# EAGLE design thermochromic heater control v2 (EAGLE 9.4.2)
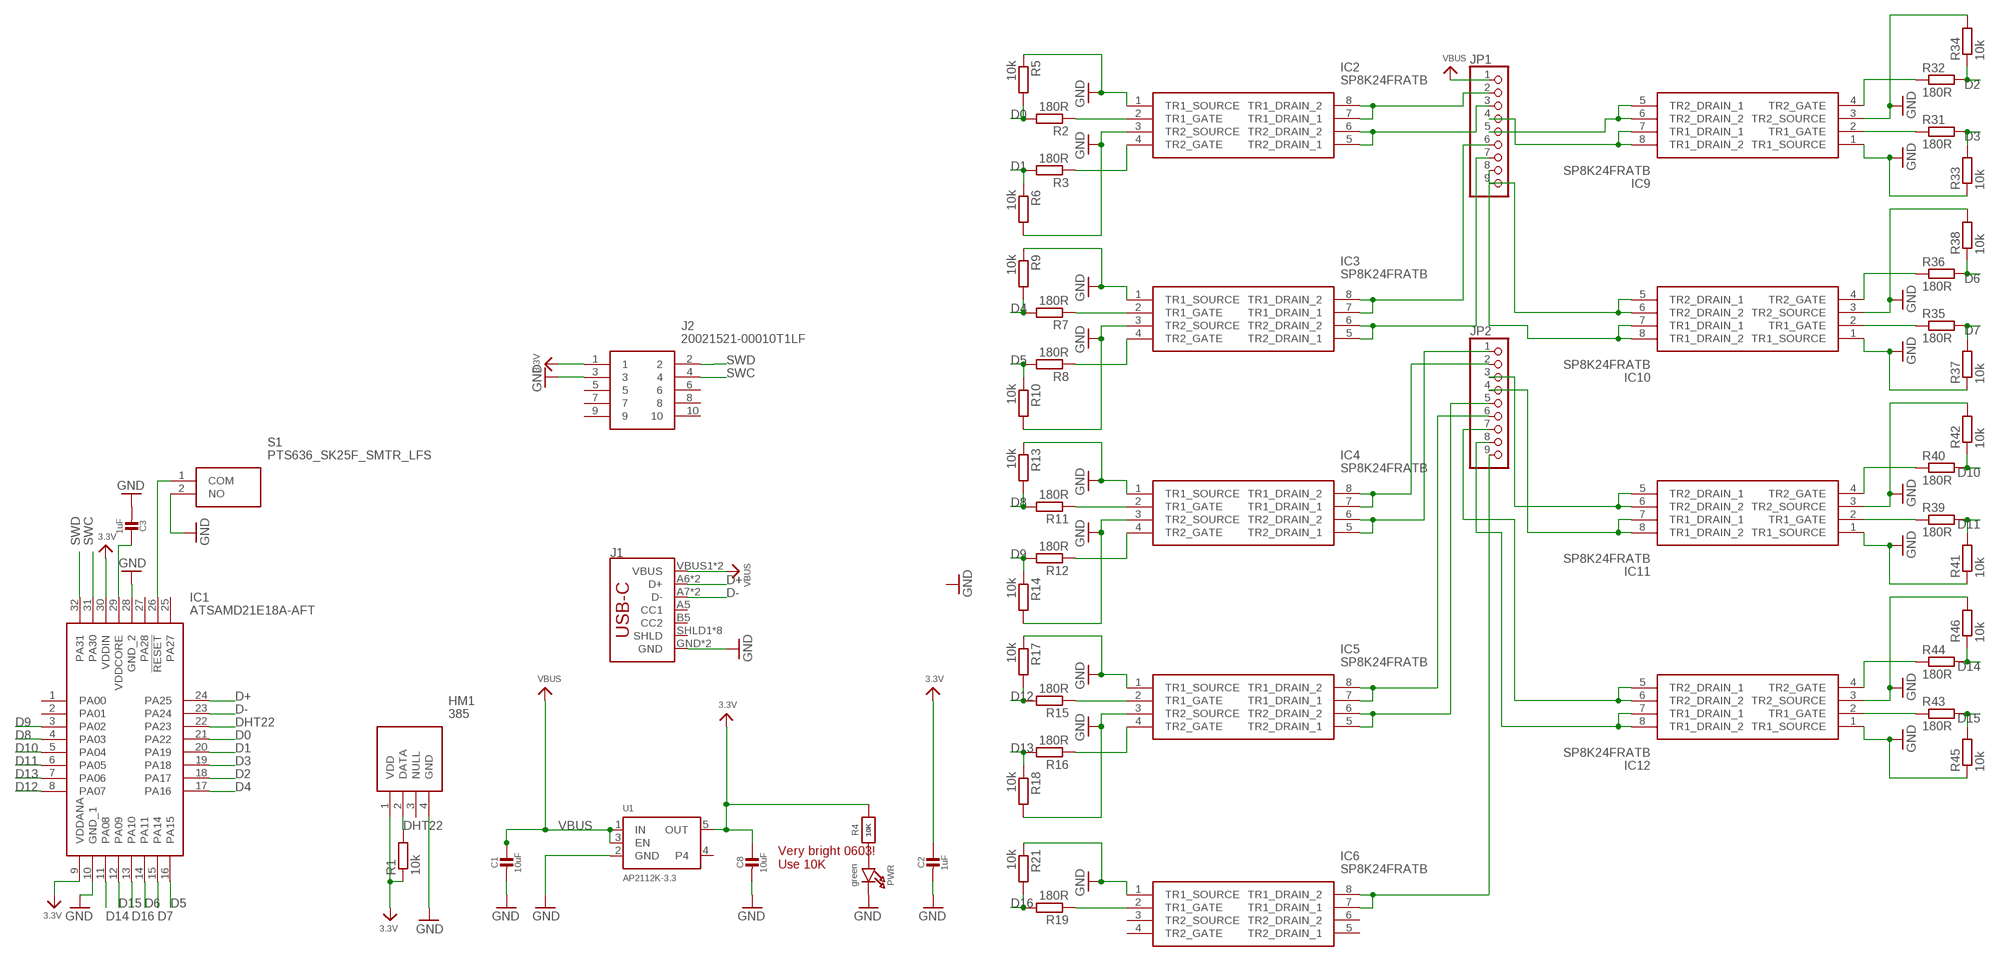
[diagram p0: schematic, sheet 1]

## Parts
C1  10uF  CAP_CERAMIC0805-NOOUTLINE  [0805-NO]
C2  1uF  CAP_CERAMIC0603_NO  [0603-NO]
C3  1uF  CAP_CERAMIC0603_NO  [0603-NO]
C8  10uF  CAP_CERAMIC0805-NOOUTLINE  [0805-NO]
HM1  385  [TO200P770X1510X2520-4P]
IC1  ATSAMD21E18A-AFT  [QFP80P900X900X120-32N]
IC2  SP8K24FRATB  [SOIC127P600X175-8N]
IC3  SP8K24FRATB  [SOIC127P600X175-8N]
IC4  SP8K24FRATB  [SOIC127P600X175-8N]
IC5  SP8K24FRATB  [SOIC127P600X175-8N]
IC6  SP8K24FRATB  [SOIC127P600X175-8N]
IC9  SP8K24FRATB  [SOIC127P600X175-8N]
IC10  SP8K24FRATB  [SOIC127P600X175-8N]
IC11  SP8K24FRATB  [SOIC127P600X175-8N]
IC12  SP8K24FRATB  [SOIC127P600X175-8N]
J1  USB_C2-LAYER  [USB-C-16P]
J2  20021521-00010T1LF  [2002152100010T1LF]
JP1  PINHD-1X9  [1X09]
JP2  PINHD-1X9  [1X09]
PWR  green  LED0603_NOOUTLINE  [CHIPLED_0603_NOOUTLINE]
R1  10k  R-EU_R0603  [R0603]
R2  180R  R-EU_R0603  [R0603]
R3  180R  R-EU_R0603  [R0603]
R4  10K  RESISTOR_0603_NOOUT  [0603-NO]
R5  10k  R-EU_R0603  [R0603]
R6  10k  R-EU_R0603  [R0603]
R7  180R  R-EU_R0603  [R0603]
R8  180R  R-EU_R0603  [R0603]
R9  10k  R-EU_R0603  [R0603]
R10  10k  R-EU_R0603  [R0603]
R11  180R  R-EU_R0603  [R0603]
R12  180R  R-EU_R0603  [R0603]
R13  10k  R-EU_R0603  [R0603]
R14  10k  R-EU_R0603  [R0603]
R15  180R  R-EU_R0603  [R0603]
R16  180R  R-EU_R0603  [R0603]
R17  10k  R-EU_R0603  [R0603]
R18  10k  R-EU_R0603  [R0603]
R19  180R  R-EU_R0603  [R0603]
R21  10k  R-EU_R0603  [R0603]
R31  180R  R-EU_R0603  [R0603]
R32  180R  R-EU_R0603  [R0603]
R33  10k  R-EU_R0603  [R0603]
R34  10k  R-EU_R0603  [R0603]
R35  180R  R-EU_R0603  [R0603]
R36  180R  R-EU_R0603  [R0603]
R37  10k  R-EU_R0603  [R0603]
R38  10k  R-EU_R0603  [R0603]
R39  180R  R-EU_R0603  [R0603]
R40  180R  R-EU_R0603  [R0603]
R41  10k  R-EU_R0603  [R0603]
R42  10k  R-EU_R0603  [R0603]
R43  180R  R-EU_R0603  [R0603]
R44  180R  R-EU_R0603  [R0603]
R45  10k  R-EU_R0603  [R0603]
R46  10k  R-EU_R0603  [R0603]
S1  PTS636_SK25F_SMTR_LFS  [PTS636SK25FSMTRLFS]
U1  AP2112K-3.3  VREG_SOT23-5  [SOT23-5]

## Nets
3.3V: C2.1 C8.1 HM1.1(VDD) IC1.9(VDDANA) IC1.30(VDDIN) J2.1 R1.1 R4.2 U1.5(OUT)
D0: IC1.21(PA22) R2.2 R5.2
D1: IC1.20(PA19) R3.2 R6.1
D2: IC1.18(PA17) R32.2 R34.1
D3: IC1.19(PA18) R31.2 R33.2
D4: IC1.17(PA16) R7.2 R9.2
D5: IC1.16(PA15) R8.2 R10.1
D6: IC1.14(PA11) R36.2 R38.1
D7: IC1.15(PA14) R35.2 R37.2
D8: IC1.4(PA03) R11.2 R13.2
D9: IC1.3(PA02) R12.2 R14.1
D10: IC1.5(PA04) R40.2 R42.1
D11: IC1.6(PA05) R39.2 R41.2
D12: IC1.8(PA07) R15.2 R17.2
D13: IC1.7(PA06) R16.2 R18.1
D14: IC1.11(PA08) R44.2 R46.1
D15: IC1.12(PA09) R43.2 R45.2
D16: IC1.13(PA10) R19.2 R21.2
D+: IC1.24(PA25) J1.A6(D+) J1.B6(D+)
D-: IC1.23(PA24) J1.A7(D-) J1.B7(D-)
DHT22: HM1.2(DATA) IC1.22(PA23) R1.2
GND: C1.2 C2.2 C3.2 C8.2 HM1.4(GND) IC1.10(GND_1) IC1.28(GND_2) IC2.1(TR1_SOURCE) IC2.3(TR2_SOURCE) IC3.1(TR1_SOURCE) IC3.3(TR2_SOURCE) IC4.1(TR1_SOURCE) IC4.3(TR2_SOURCE) IC5.1(TR1_SOURCE) IC5.3(TR2_SOURCE) IC6.1(TR1_SOURCE) IC9.1(TR1_SOURCE) IC9.3(TR2_SOURCE) IC10.1(TR1_SOURCE) IC10.3(TR2_SOURCE) IC11.1(TR1_SOURCE) IC11.3(TR2_SOURCE) IC12.1(TR1_SOURCE) IC12.3(TR2_SOURCE) J1.GND J1.GND2(GND) J2.3 PWR.C R5.1 R6.2 R9.1 R10.2 R13.1 R14.2 R17.1 R18.2 R21.1 R33.1 R34.2 R37.1 R38.2 R41.1 R42.2 R45.1 R46.2 S1.2(NO) U1.2(GND)
N$3: C3.1 IC1.29(VDDCORE)
N$4: IC2.2(TR1_GATE) R2.1
N$5: IC1.26(!RESET) S1.1(COM)
N$6: PWR.A R4.1
N$7: IC2.4(TR2_GATE) R3.1
N$8: IC2.7(TR1_DRAIN_1) IC2.8(TR1_DRAIN_2) JP1.2
N$9: IC2.5(TR2_DRAIN_1) IC2.6(TR2_DRAIN_2) JP1.3
N$10: IC10.2(TR1_GATE) R35.1
N$11: IC3.2(TR1_GATE) R7.1
N$12: IC3.4(TR2_GATE) R8.1
N$13: IC3.7(TR1_DRAIN_1) IC3.8(TR1_DRAIN_2) JP1.6
N$14: IC3.5(TR2_DRAIN_1) IC3.6(TR2_DRAIN_2) JP1.7
N$15: IC4.2(TR1_GATE) R11.1
N$16: IC4.4(TR2_GATE) R12.1
N$17: IC4.7(TR1_DRAIN_1) IC4.8(TR1_DRAIN_2) JP2.2
N$18: IC4.5(TR2_DRAIN_1) IC4.6(TR2_DRAIN_2) JP2.1
N$19: IC5.2(TR1_GATE) R15.1
N$20: IC5.4(TR2_GATE) R16.1
N$21: IC5.7(TR1_DRAIN_1) IC5.8(TR1_DRAIN_2) JP2.6
N$22: IC5.5(TR2_DRAIN_1) IC5.6(TR2_DRAIN_2) JP2.5
N$23: IC6.2(TR1_GATE) R19.1
N$25: IC6.7(TR1_DRAIN_1) IC6.8(TR1_DRAIN_2) JP2.9
N$35: IC9.2(TR1_GATE) R31.1
N$36: IC9.4(TR2_GATE) R32.1
N$37: IC9.7(TR1_DRAIN_1) IC9.8(TR1_DRAIN_2) JP1.4
N$38: IC9.5(TR2_DRAIN_1) IC9.6(TR2_DRAIN_2) JP1.5
N$39: IC10.4(TR2_GATE) R36.1
N$40: IC10.7(TR1_DRAIN_1) IC10.8(TR1_DRAIN_2) JP1.8
N$41: IC10.5(TR2_DRAIN_1) IC10.6(TR2_DRAIN_2) JP1.9
N$42: IC11.2(TR1_GATE) R39.1
N$43: IC11.4(TR2_GATE) R40.1
N$44: IC11.7(TR1_DRAIN_1) IC11.8(TR1_DRAIN_2) JP2.4
N$45: IC11.5(TR2_DRAIN_1) IC11.6(TR2_DRAIN_2) JP2.3
N$46: IC12.2(TR1_GATE) R43.1
N$47: IC12.4(TR2_GATE) R44.1
N$48: IC12.7(TR1_DRAIN_1) IC12.8(TR1_DRAIN_2) JP2.8
N$49: IC12.5(TR2_DRAIN_1) IC12.6(TR2_DRAIN_2) JP2.7
SWC: IC1.31(PA30) J2.4
SWD: IC1.32(PA31) J2.2
VBUS: C1.1 J1.VBUS1(VBUS) J1.VBUS2(VBUS) JP1.1 U1.1(IN) U1.3(EN)
Unconnected: HM1.3(NULL) IC1.1(PA00) IC1.2(PA01) IC1.25(PA27) IC1.27(PA28) IC6.3(TR2_SOURCE) IC6.4(TR2_GATE) IC6.5(TR2_DRAIN_1) IC6.6(TR2_DRAIN_2) J1.A5(CC1) J1.B5(CC2) J1.SHLD1(SHLD) J1.SHLD2(SHLD) J1.SHLD3(SHLD) J1.SHLD4(SHLD) J1.SHLD5(SHLD) J1.SHLD6(SHLD) J1.SHLD7(SHLD) J1.SHLD8(SHLD) J2.5 J2.6 J2.7 J2.8 J2.9 J2.10 U1.4

## Notes on the sheet
- Very bright 0603!
  Use 10K

## Library data of the parts
C1-C3 C8 = microbuilder:CAP_CERAMIC: Ceramic Capacitors For new designs, use the packages preceded by an '_' character since they are more reliable: The following footprints should be used on most boards: _0402 - Standard footprint for regular board layouts _0603 - Standard footprint for regular board layouts _0805 - Standard footprint for regular board layouts _1206 - Standard footprint for regular board layouts For extremely tight-pitch boards where space is at a premium, the following 'micro-pitch' footprints can be used (smaller pads, no silkscreen outline, etc.): _0402MP - Micro-pitch footprint for very dense/compact boards _0603MP - Micro-pitch footprint for very dense/compact boards _0805MP - Micro-pitch footprint for very dense/compact boards _1206MP - Micro-pitch footprint for very dense/compact boards
HM1 = SamacSys_Parts:385: Adafruit Accessories DHT22 Temp/Humidity Sensor Source: Datasheet <https://cdn-shop.adafruit.com/datasheets/DHT22.pdf>; DESCRIPTION: Adafruit Accessories DHT22 Temp/Humidity Sensor; HEIGHT: 7.7mm; MANUFACTURER_NAME: Adafruit; MANUFACTURER_PART_NUMBER: 385; MOUSER_PART_NUMBER: 485-385; MOUSER_PRICE-STOCK: https://www.mouser.com/Search/Refine.aspx?Keyword=485-385
IC1 = SamacSys_Parts:ATSAMD21E18A-AFT: ARM Microcontrollers - MCU Cortex-M0+,64KB FLASH,8KB SRAM T&R, - 32TQFP 125C, GREEN,1.6-3.6V,48MHz Source: Datasheet <http://www.microchip.com/mymicrochip/filehandler.aspx?ddocname=en590209>; DESCRIPTION: ARM Microcontrollers - MCU Cortex-M0+,64KB FLASH,8KB SRAM T&R, - 32TQFP 125C, GREEN,1.6-3.6V,48MHz; HEIGHT: 1.2mm; MANUFACTURER_NAME: Microchip; MANUFACTURER_PART_NUMBER: ATSAMD21E18A-AFT; MOUSER_PART_NUMBER: 556-ATSAMD21E18A-AFT; MOUSER_PRICE-STOCK: https://www.mouser.com/Search/Refine.aspx?Keyword=556-ATSAMD21E18A-AFT
IC2-IC6 IC9-IC12 = SamacSys_Parts:SP8K24FRATB: MOSFET Nch+Nch 45V Vds 6A 0.036Rds(on) 15.4Qg Source: Datasheet <https://componentsearchengine.com/Datasheets/2/SP8K24FRATB.pdf>; DESCRIPTION: MOSFET Nch+Nch 45V Vds 6A 0.036Rds(on) 15.4Qg; HEIGHT: 1.75mm; MANUFACTURER_NAME: ROHM Semiconductor; MANUFACTURER_PART_NUMBER: SP8K24FRATB; MOUSER_PART_NUMBER: 755-SP8K24FRATB; MOUSER_PRICE-STOCK: https://www.mouser.com/Search/Refine.aspx?Keyword=755-SP8K24FRATB
J1 = SparkFun-Connectors:USB_C: USB Type C 16Pin Connector Super Speed pins not available on the 16-pin purely SMD connector so this part is best for USB 2.0 implementations. D1 and D2 are tied together enabling D+/- no matter which way the cable is plugged into the connector. The two channel configuration pins (CC1/2) are exposed. These are normally connected to ground via 5.1k resistors but can be reconfigured for high current/high power applications.; PROD_ID: CONN-14122
J2 = SamacSys_Parts:20021521-00010T1LF: Headers & Wire Housings Cable-to-Board, Hdr Shrouded, SMT, 10P Source: Datasheet <https://www.mouser.it/datasheet/2/18/20021521-1362765.pdf>; ALLIED_NUMBER: 70277217; ALLIED_PRICE-STOCK: https://www.alliedelec.com/amphenolfci-20021521-00010t1lf/70277217/; DESCRIPTION: Headers & Wire Housings Cable-to-Board, Hdr Shrouded, SMT, 10P; HEIGHT: 5.4mm; MANUFACTURER_NAME: Amphenol; MANUFACTURER_PART_NUMBER: 20021521-00010T1LF; MOUSER_PART_NUMBER: 649-200215210010T1LF; MOUSER_PRICE-STOCK: https://www.mouser.com/Search/Refine.aspx?Keyword=649-200215210010T1LF; RS_PART_NUMBER: 8633295; RS_PRICE-STOCK: http://uk.rs-online.com/web/p/products/8633295
JP1 JP2 = pinhead:PINHD-1X9: PIN HEADER
PWR = microbuilder:LED: LED 0603 - 0603 Surface Mount Package 2mA: Green LED - Low Power (3.9mcd, 2ma, 1.7Vf) - Digikey: 475-2709-2-ND Orange LED - Low Power (9.8mcd, 2ma, 1.8Vf) - Digikey: 475-1194-2-ND Red LED - Low Power (5mcd, 2ma, 1.8Vf) - Digikey: 475-1195-2-ND Yellow LED - Low Power (7mcd, 2ma, 1.8Vf) - Digikey: 475-1196-2-ND 5mA: Blue LED - Low Power (17mcd, 5ma, 2.9Vf) - Digikey: LNJ937W8CRACT-ND 0805 - 0805 Surface Mount Package 2mA: Red LED (8.8mcd, 2mA, 1.8Vf, Clear) - Low Power [Digikey: 475-2510-1-ND] Green LED (5mcd, 2mA, 1.8Vf, Clear) - Low Power [Digikey: 475-2730-1-ND] Yellow LED (11.3mcd, 2mA, 1.8Vf, Clear) - Low Power [Digikey: 475-2555-1-ND] 20mA: Red LED (104mcd, 20mA, Diffused) - LS R976 [Digikey: 475-1278-6-ND] Red LED (12mcd, 20mA, 2.0Vf, Clear) - APT2012EC [Digikey: 754-1128-1-ND] Green LED (15mcd, 20mA, 2.2Vf, Clear) - APT2012GC [Digikey: 754-1131-1-ND] Orange LED (160mcd, 20mA, 2.1Vf, Clear) - APT2012SECK [Digikey: 754-1130-1-ND] 1206 - 1206 Surface Mount Package Green LED (26mcd, 20mA, Diffused) - LG N971 [Digikey: 475-1407-6-ND] Red LED (15mcd, 20mA, Diffused) - LH N974 [Digikey: 475-1416-6-ND] Cree - Cree High-Power Surface Mount LEDs XPEBWT-L1-0000-00D50 - White 111lm 350mA 2.9Vf 6200K 110° XTEAWT-00-0000-00000LEE3 - White 114lm 350mA 2.85Vf 5000K 115° Everlight - Everlight 45-21 Series Surface Mount LEDs 45-21/QK2C-B2832AC2CB2/2T - Warm White 2000mcd 20mA 3.25Vf 3050K 120° 45-21/LK2C-B38452C4CB2/2T - Nuetral White 2000mcd 20mA 3.25Vf 4150K 120° 45-21/LK2C-B50634C6CB2/2T - Cold White 2200mcd 20mA 3.25Vf 5650K 120° PLCC2 Reverse Mount LS T77K-J1L2-1-0-2-R18-Z - Red 11.25mcd 2mA 1.8Vf 630nm 120° LO T77K-L1M2-24-Z - Orange 19.6mcd 2mA 1.8Vf 606nm 120° LY T77K-K2M1-26-Z - Yellow 15.7mcd 2mA 1.8Vf 587nm 120°
R1-R3 R5-R19 R21 R31-R46 = rcl:R-EU_: RESISTOR, European symbol; SPICEPREFIX: R
R4 = microbuilder:RESISTOR: Resistors For new designs, use the packages preceded by an '_' character since they are more reliable: The following footprints should be used on most boards: _0402 - Standard footprint for regular board layouts _0603 - Standard footprint for regular board layouts _0805 - Standard footprint for regular board layouts _1206 - Standard footprint for regular board layouts For extremely tight-pitch boards where space is at a premium, the following 'micro-pitch' footprints can be used (smaller pads, no silkscreen outline, etc.): _0402MP - Micro-pitch footprint for very dense/compact boards _0603MP - Micro-pitch footprint for very dense/compact boards _0805MP - Micro-pitch footprint for very dense/compact boards _1206MP - Micro-pitch footprint for very dense/compact boards
S1 = SamacSys_Parts:PTS636_SK25F_SMTR_LFS: Tactile Switches Tact 50mA 12VDC, 6.0x3.5, 2.5mm H, 250gf, F leads, No ground pin, Red Actuator Source: Datasheet <https://componentsearchengine.com/Datasheets/1/PTS636 SK25F SMTR LFS.pdf>; DESCRIPTION: Tactile Switches Tact 50mA 12VDC, 6.0x3.5, 2.5mm H, 250gf, F leads, No ground pin, Red Actuator; HEIGHT: 2.7mm; MANUFACTURER_NAME: C & K COMPONENTS; MANUFACTURER_PART_NUMBER: PTS636 SK25F SMTR LFS; MOUSER_PART_NUMBER: 611-PTS636SK25FSMTRL; MOUSER_PRICE-STOCK: https://www.mouser.com/Search/Refine.aspx?Keyword=611-PTS636SK25FSMTRL
U1 = microbuilder:VREG_SOT23-5: SOT23-5 Fixed Voltage Regulators Part Current Out V Out V In V Dropout θJA (°C/W) TJ (°C) Digikey Part No. ADP121 150mA 3.3V 3.4-5.5V 0.09V @ 150mA -- -- ADP121-AUJZ33R7CT-ND ADP121 150mA 3.0V 3.1-5.5V 0.09V @ 150mA -- -- ADP121-AUJZ30R7CT-ND ADP122 300mA 3.3V 3.4-5.5V 0.085V @ 300mA -- -- ADP122AUJZ-3.3-R7CT-ND ADP1712 300mA 3.3V 3.5-5.5V 0.17V @ 300mA -- -- ADP1712AUJZ-3.3-R7TR-ND AP7311 (Low Cost) 150mA 3.3V 3.5-6V 0.15V @ 150mA -- -- AP7311-33WG-7DICT-ND LD39015M18R 150mA 1.8V 1.9V-5.5V 0.08V @ 100mA -- -- 497-6977-1-ND LP2985A-33DBVR 150mA 3.3V 3.3-16V 0.28V @ 150mA 206 150 296-18479-1-ND MCP1824T-3302E/OT 300mA 3.3V 3.5V-6V 0.2V @ 300mA -- -- MCP1824T-3302E/OTCT-ND MIC5205-2.5YM5 TR 150mA 2.5V 2.7-16V 0.165V @ 150mA -- -- 576-1257-2-ND MIC5205-3.0YM5 TR 150mA 3.0V 3.2V-16V 0.165V @ 150mA -- -- 576-1258-2-ND MIC5205-3.3YM5 TR 150mA 3.3V 3.5V-16V 0.165V @ 150mA -- -- 576-1259-2-ND TPS780330220 150mA 3.3V+2.2V 3.6-5.5V 250mV Max -- -- 296-23332-1-ND TDA3663/N1,135 100mA 3.3V 3.5-45V 0.18V @ 50mA -- -- 568-5343-1-ND Max operating temp can be calculated using θJA, TJ (max junction temperature), and power in watts. Set the "Maximum Ambient Temperature" until it reaches TJ ("Max Junction Temperature"), which is the absolute limit for safe use of the regulator: Heat Sink Temperature Calculator <http://www.daycounter.com/Calculators/Heat-Sink-Temperature-Calculator.phtml> For example, With 12V source into a 3.3V LP2985 and a 30mA load, we are dissipating (12V-3.3V) * 0.03A = 0.261W. With a θJA of 206 °C/W, a TJ of 150°C, and 261mW we can safely use the chip without a heat sink up to 75°C (=147.1°C Junction Temperature).

## Net classes
1 power: width 0.305 mm

## Board
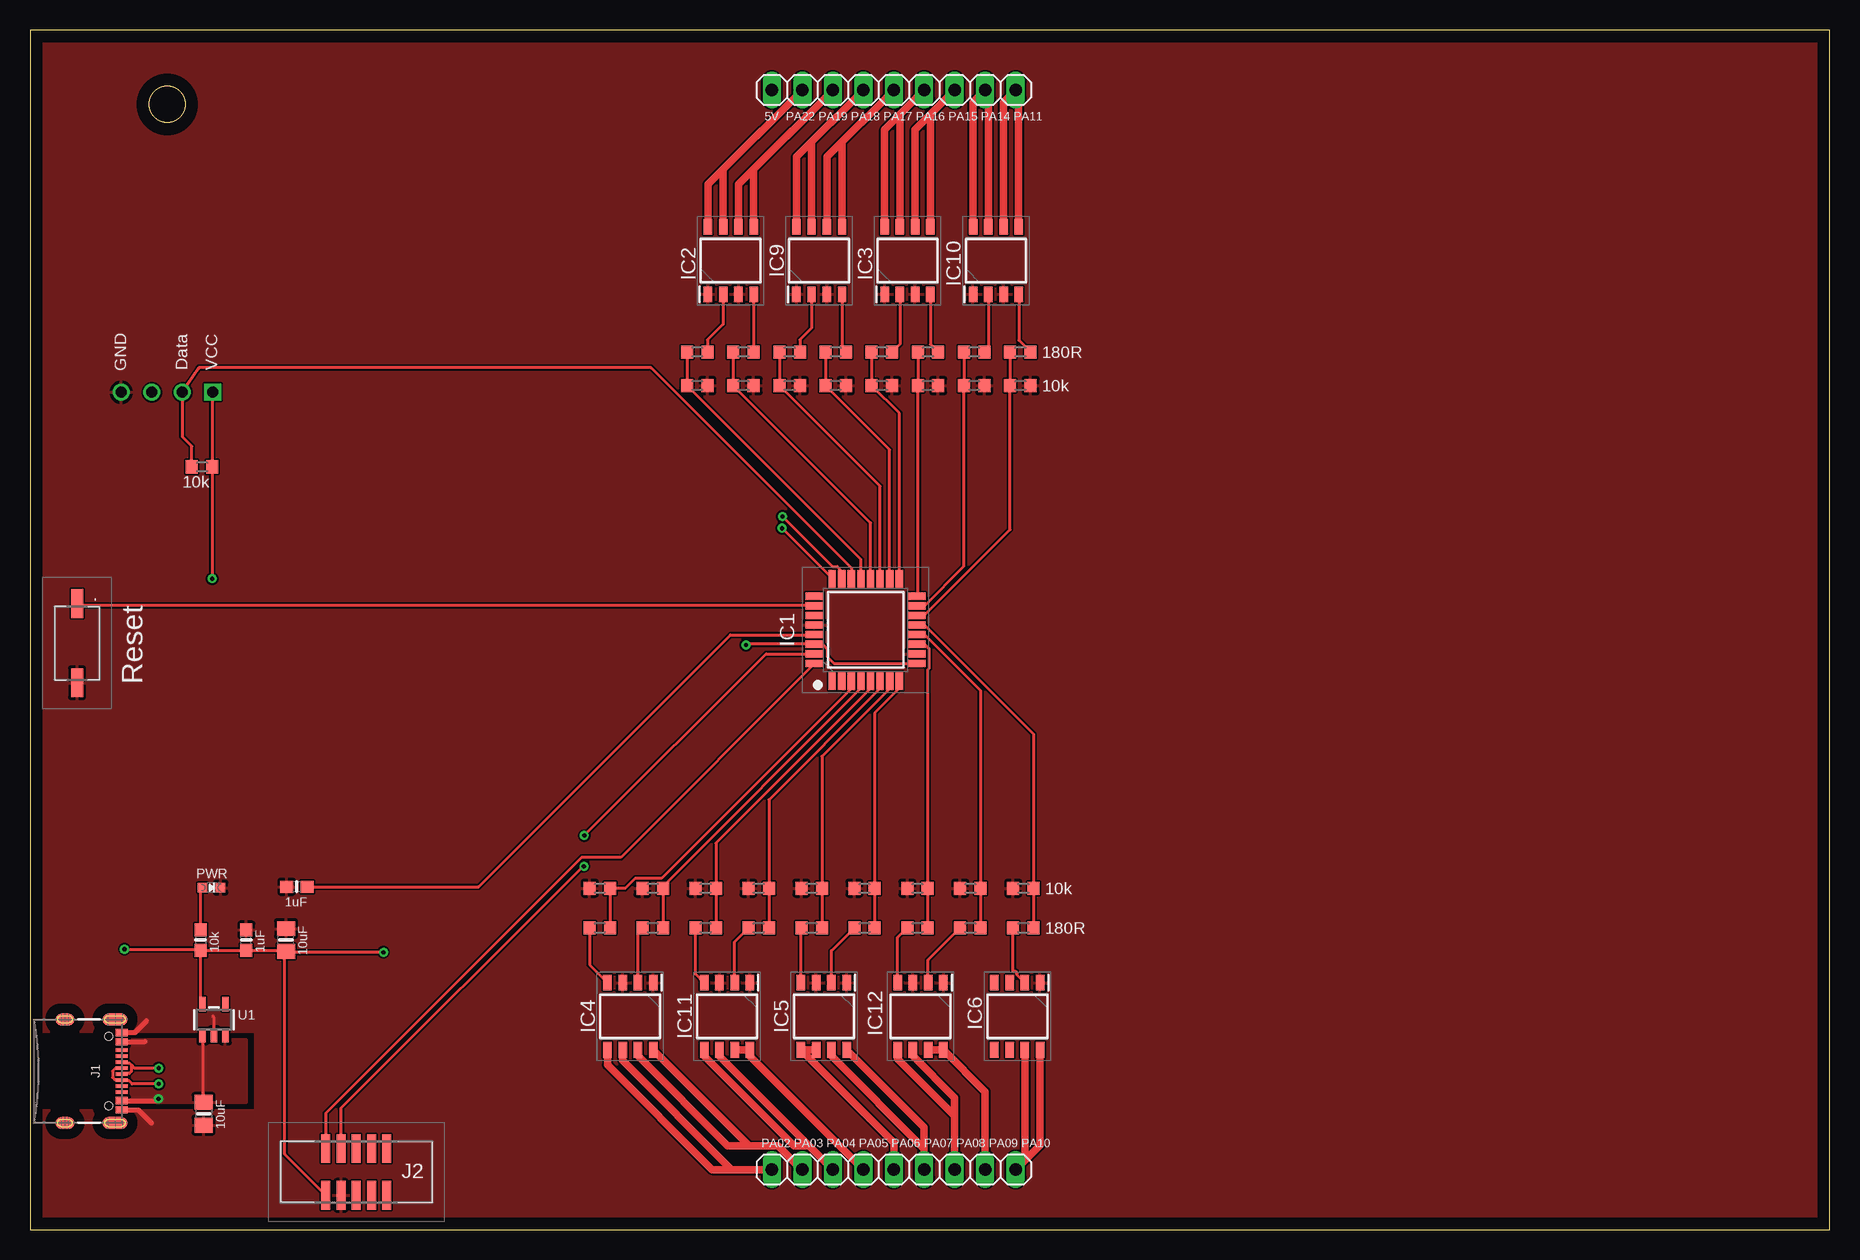
[diagram p1: board, top side]
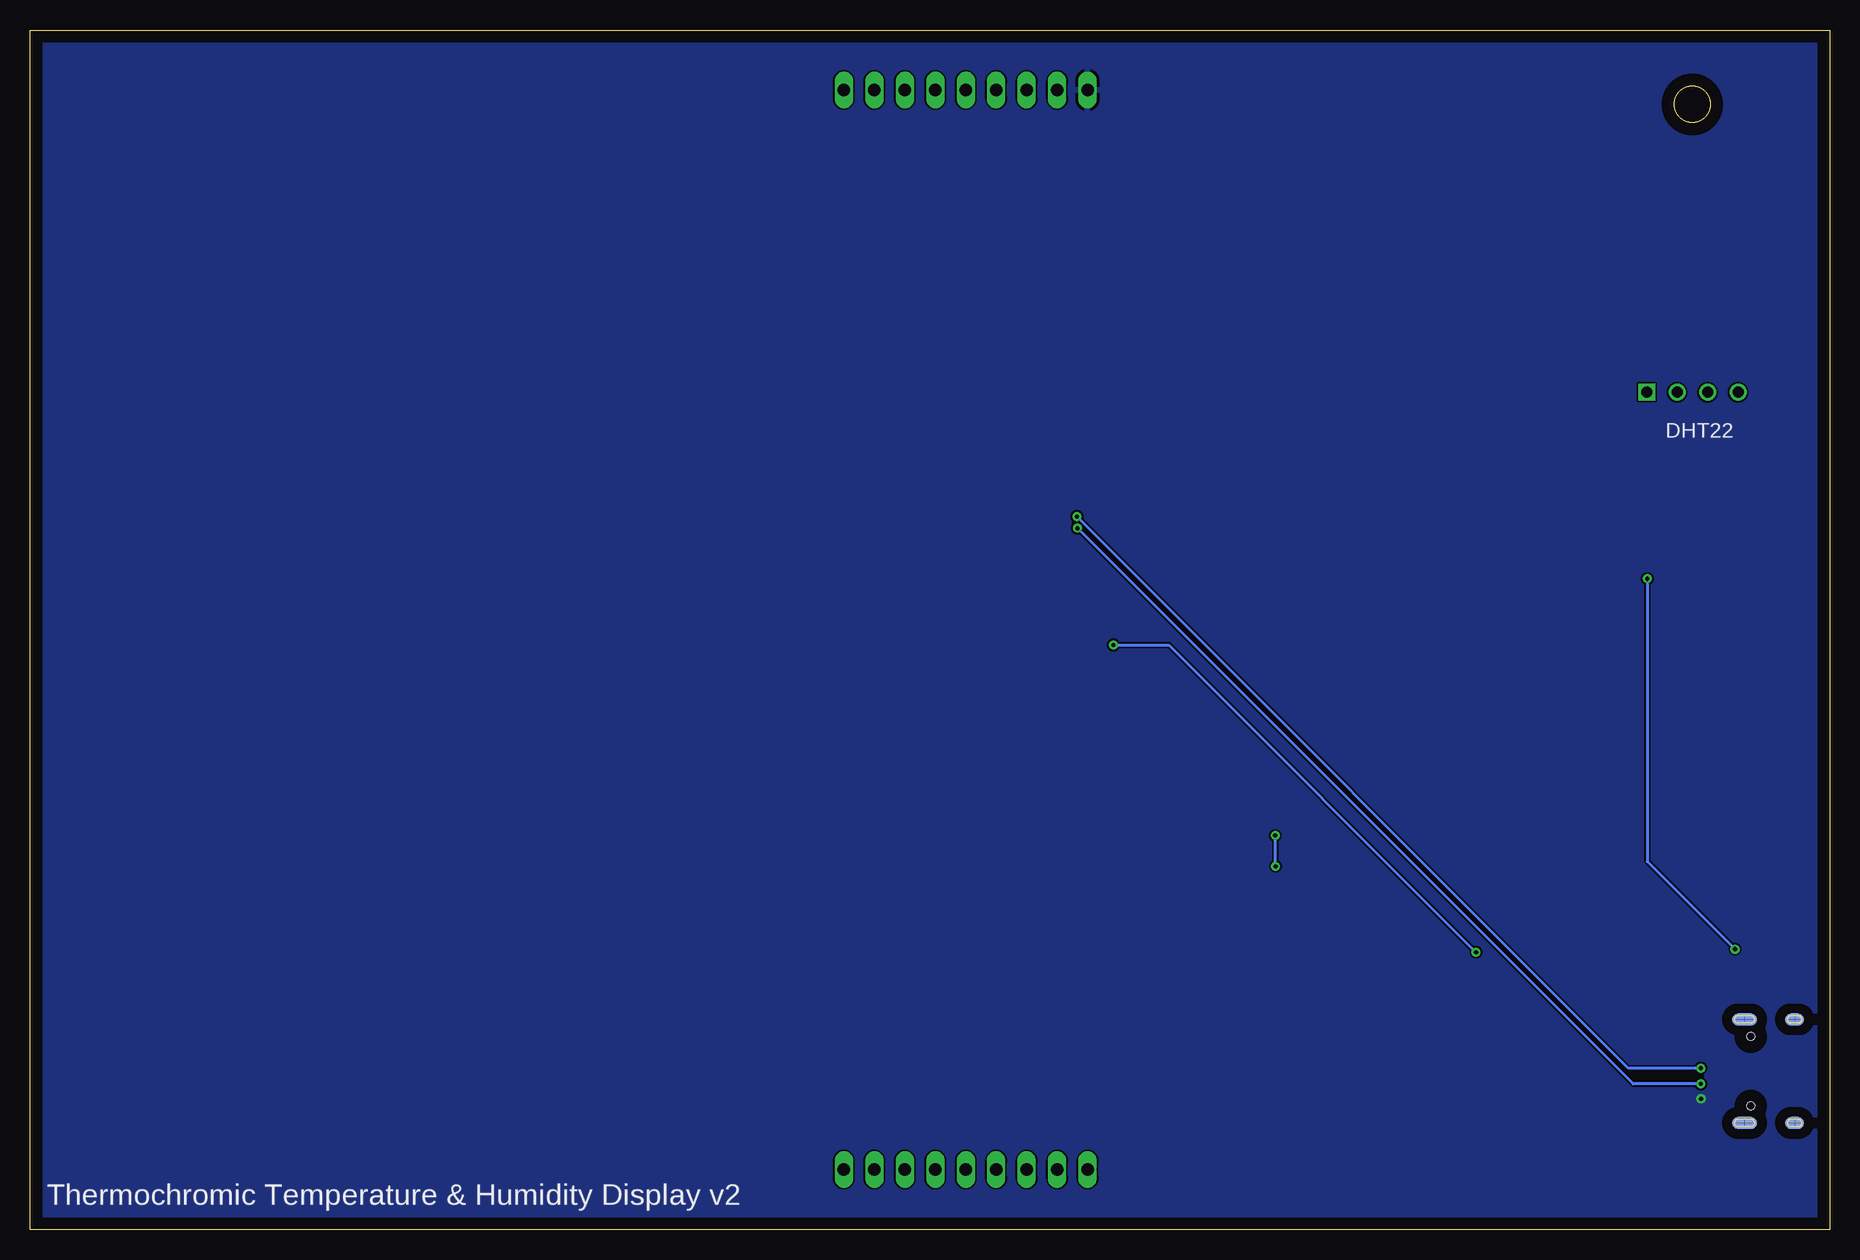
[diagram p2: board, bottom side, seen from below]

Size 150 x 100 mm. Coordinates in mm from the lower left corner, seen from the top.
Outline: 0,0 150,0 150,100 0,100 0,0
Outline: circle at 11.43,93.8 radius 1.5
Copper layers (1*16): Top 0.035mm / dielectric 1.5mm / Bottom 0.035mm
Design rules "default": minimum track width 6mil, minimum drill 0.35mm, track to track 6mil, track to pad 6mil, pad to pad 6mil, via to via 6mil, smd to smd 6mil, copper to edge 40mil, drill to drill 6mil, minimum pad ring 10mil, minimum via ring 8mil, stop-mask expansion 4mil, vias tented up to drill 0mil, thermal gap 10mil

### Footprints (pad centres in the part's own frame; a part is rotated, then mirrored left to right if it is on the bottom)
0805-NO = smd 1.24 x 1.5: 1 -0.95,0; 2 0.95,0
0603-NO = smd 1.075 x 1: 1 -0.85,0; 2 0.85,0
TO200P770X1510X2520-4P = drill 0.91 pad 1.365 square: 1 0,0 | drill 0.91 pad 1.365: 2 2.54,0; 3 5.08,0; 4 7.62,0
QFP80P900X900X120-32N = smd 1.5 x 0.6: 1 -4.25,2.8; 2 -4.25,2; 3 -4.25,1.2; 4 -4.25,0.4; 5 -4.25,-0.4; 6 -4.25,-1.2; 7 -4.25,-2; 8 -4.25,-2.8; 17 4.25,-2.8; 18 4.25,-2; 19 4.25,-1.2; 20 4.25,-0.4; 21 4.25,0.4; 22 4.25,1.2; 23 4.25,2; 24 4.25,2.8 | smd 0.6 x 1.5: 9 -2.8,-4.25; 10 -2,-4.25; 11 -1.2,-4.25; 12 -0.4,-4.25; 13 0.4,-4.25; 14 1.2,-4.25; 15 2,-4.25; 16 2.8,-4.25; 25 2.8,4.25; 26 2,4.25; 27 1.2,4.25; 28 0.4,4.25; 29 -0.4,4.25; 30 -1.2,4.25; 31 -2,4.25; 32 -2.8,4.25
SOIC127P600X175-8N = smd 1.3 x 0.7: 1 -2.8,1.905; 2 -2.8,0.635; 3 -2.8,-0.635; 4 -2.8,-1.905; 5 2.8,-1.905; 6 2.8,-0.635; 7 2.8,0.635; 8 2.8,1.905
USB-C-16P = smd 0.3 x 1: A5 -1.25,-0.34; A6 -0.25,-0.34; A7 0.25,-0.34; A8 1.25,-0.34; B5 1.75,-0.34; B6 0.75,-0.34; B7 -0.75,-0.34; B8 -1.75,-0.34 | smd 0.6 x 1: GND -3.225,-0.34; GND2 3.225,-0.34; VBUS1 -2.45,-0.34; VBUS2 2.45,-0.34 | smd 1 x 2.1: SHLD1 -4.32,-0.915; SHLD2 4.32,-0.915 | smd 1 x 2.1 bottom: SHLD3 -4.32,-0.915; SHLD4 4.32,-0.915 | smd 1 x 1.6: SHLD5 -4.32,-5.095; SHLD8 4.32,-5.095 | smd 1 x 1.6 bottom: SHLD6 -4.32,-5.095; SHLD7 4.32,-5.095 | hole 0.65: -2.89,-1.445; 2.89,-1.445
2002152100010T1LF = smd 0.76 x 2.4: 1 -2.54,-1.95; 2 -2.54,1.95; 3 -1.27,-1.95; 4 -1.27,1.95; 5 0,-1.95; 6 0,1.95; 7 1.27,-1.95; 8 1.27,1.95; 9 2.54,-1.95; 10 2.54,1.95
1X09 = drill 1.016 long: 1 -10.16,0; 2 -7.62,0; 3 -5.08,0; 4 -2.54,0; 5 0,0; 6 2.54,0; 7 5.08,0; 8 7.62,0; 9 10.16,0
CHIPLED_0603_NOOUTLINE = smd 0.8 x 0.8: A 0,-0.75; C 0,0.75
R0603 = smd 1 x 1.1: 1 -0.85,0; 2 0.85,0
PTS636SK25FSMTRLFS = smd 2.4 x 1: 1 -3.3,0; 2 3.3,0
SOT23-5 = smd 0.55 x 1.2: 1 -0.95,-1.3; 2 0,-1.3; 3 0.95,-1.3; 4 0.95,1.3; 5 -0.95,1.3

### Placement (x,y rotation side)
C1  14.48,9.65 270 top
C2  18.03,24.13 90 top
C3  22.24,28.58 180 top
C8  21.34,24.13 90 top
HM1  15.24,69.8 0 bottom
IC1  69.67,50 90 top
IC2  58.41,80.77 90 top
IC3  73.15,80.77 90 top
IC4  50.04,17.78 270 top
IC5  66.17,17.78 270 top
IC6  82.3,17.78 270 top
IC9  65.78,80.77 90 top
IC10  80.52,80.77 90 top
IC11  58.1,17.78 270 top
IC12  74.23,17.78 270 top
J1  8,13.2 270 top
J2  27.2,4.8 0 top
JP1  72,95 0 top
JP2  72,5 0 top
PWR  15.13,28.5 270 top
R1  14.34,63.58 180 top
R2  55.63,73.15 180 top
R3  59.47,73.15 180 top
R4  14.22,24.13 270 top
R5  55.63,70.36 180 top
R6  59.47,70.36 0 top
R7  71.01,73.15 180 top
R8  74.86,73.15 180 top
R9  71.01,70.36 180 top
R10  74.86,70.36 0 top
R11  51.91,25.15 0 top
R12  47.5,25.15 0 top
R13  51.91,28.45 0 top
R14  47.5,28.45 180 top
R15  69.56,25.15 0 top
R16  65.15,25.15 0 top
R17  69.56,28.45 0 top
R18  65.15,28.45 180 top
R19  82.8,25.15 0 top
R21  82.8,28.45 0 top
R31  63.32,73.15 180 top
R32  67.16,73.15 180 top
R33  63.32,70.36 180 top
R34  67.16,70.36 0 top
R35  78.7,73.15 180 top
R36  82.55,73.15 180 top
R37  78.7,70.36 180 top
R38  82.55,70.36 0 top
R39  60.74,25.15 0 top
R40  56.32,25.15 0 top
R41  60.74,28.45 0 top
R42  56.32,28.45 180 top
R43  78.39,25.15 0 top
R44  73.98,25.15 0 top
R45  78.39,28.45 0 top
R46  73.98,28.45 180 top
S1  3.93,48.88 270 top
U1  15.34,17.48 0 top

### Tracks (layer width: path | path; a pad name or v marks a point on that pad's centre or on a via)
3.3V  (via drill 0.35)
  Top 0.254: U1.5 14.22,18.95 R4.2 | R4.2 C2.1 21.24,23.28 | 21.24,23.28 C8.1 21.4,23.11 v29.46,23.11 | IC1.9 67.02,47.2 66.44,47.77 66.44,48.42 66.05,48.81 IC1.30 59.77,48.8 v59.69,48.72 | HM1.1 15.19,69.77 R1.1 v15.19,54.26 v15.19,54.25 | v7.87,23.37 14.14,23.37 R4.2 | J2.1 21.24,6.27 21.24,23.28
  Bottom 0.254: v59.69,48.72 55.07,48.72 v29.46,23.11 | v15.19,54.25 15.19,30.68 v7.87,23.37
D0
  Top 0.254: R2.2 R5.2 69.27,55.87 IC1.21
D1
  Top 0.254: R3.2 R6.1 70.07,58.91 IC1.20
D2
  Top 0.254: R32.2 R34.1 71.67,65.01 IC1.18
D3
  Top 0.254: R31.2 R33.2 70.87,61.96 IC1.19
D4
  Top 0.254: R7.2 R9.2 72.47,68.05 IC1.17
D5
  Top 0.254: R8.2 R10.1 74.01,52.89 IC1.16
D6
  Top 0.254: R36.2 R38.1 81.7,58.34 74.58,51.22 73.93,51.22 IC1.14
D7
  Top 0.254: R35.2 R37.2 77.85,55.29 74.55,51.99 IC1.15
D8
  Top 0.254: R11.2 R13.2 52.76,28.6 69.25,45.09 69.25,45.73 IC1.4
D9
  Top 0.254: R12.2 R14.1 49.62,28.45 50.45,29.28 52.64,29.28 68.47,45.11 IC1.3
D10
  Top 0.254: R40.2 R42.1 57.17,32.21 70.07,45.11 IC1.5
D11
  Top 0.254: R39.2 R41.2 61.59,35.83 70.87,45.11 IC1.6
D12
  Top 0.254: R15.2 R17.2 70.41,43.05 72.45,45.09 72.45,45.73 IC1.8
D13
  Top 0.254: R16.2 R18.1 66,39.44 71.67,45.11 IC1.7
D14
  Top 0.254: R44.2 R46.1 74.83,46.67 74.94,46.78 74.94,48.42 74.55,48.81 IC1.11
D15
  Top 0.254: R43.2 R45.2 79.24,44.92 74.55,49.61 IC1.12
D16
  Top 0.254: R19.2 R21.2 83.65,41.31 74.55,50.41 IC1.13
D+  (via drill 0.35)
  Top 0.254: v62.7,58.46 66.87,54.29 IC1.24 | v10.74,12.14 8.52,12.14 8.28,12.38 7.73,12.38 J1.B6 7.59,12.52 7.04,12.52 6.88,12.68 6.88,13.22 7.09,13.43 7.64,13.43 J1.A6
  Bottom 0.254: v10.74,12.14 16.37,12.14 v62.7,58.46
D-  (via drill 0.35)
  Top 0.254: v62.74,59.44 66.89,55.28 67.28,55.28 67.67,54.9 IC1.23 | v10.74,13.45 8.7,13.45 8.44,13.72 | 8.44,13.72 8.28,13.88 7.73,13.88 J1.B7 | 8.44,13.72 8.44,13.18 8.28,13.02 7.73,13.02 J1.A7
  Bottom 0.254: v10.74,13.45 16.75,13.45 v62.74,59.44
DHT22
  Top 0.254: IC1.22 68.47,55.14 51.77,71.85 14.07,71.85 14.07,71.8 HM1.2 12.7,66.09 13.49,65.3 R1.2
GND
  Top 0.254: U1.2 15.34,17.68 15.24,17.78
  Top 0.406: J1.GND2 9.02,9.97 10.11,8.89 | J1.GND 8.75,16.43 9.73,17.4
  pour Top: 0.56,9.96 18.8,9.96 18.8,16.46 0.3,16.46 -1.27,18.03 -1.27,101.35 150.11,101.35 152.15,99.31 152.15,-1.52 0.25,-1.52 -0.76,-0.51 -0.76,8.64
N$3
  Top 0.254: C3.1 37.39,28.58 58.39,49.58 65.19,49.58 65.21,49.6 IC1.29
N$4
  Top 0.254: IC2.2 57.78,75.47 56.48,74.17 R2.1
N$5
  Top 0.254: S1.1 4.1,52 65.31,52 IC1.26
N$6
  Top 0.254: R4.1 14.22,28.34 PWR.A
N$7
  Top 0.254: IC2.4 R3.1
N$8
  Top 0.61: IC2.7 57.78,88.4 JP1.2 56.51,87.13 IC2.8
N$9
  Top 0.61: IC2.5 60.32,88.4 JP1.3 59.05,87.13 IC2.6
N$10
  Top 0.254: IC10.2 79.88,73.48 R35.1
N$11
  Top 0.254: IC3.2 72.52,73.81 R7.1
N$12
  Top 0.254: IC3.4 75.06,73.8 R8.1
N$13
  Top 0.61: IC3.7 72.52,92.97 JP1.6 71.25,91.7 IC3.8
N$14
  Top 0.61: IC3.5 75.06,92.97 JP1.7 73.78,91.7 IC3.6
N$15
  Top 0.254: IC4.2 50.67,24.76 R11.1
N$16
  Top 0.254: R12.1 46.65,22.07 IC4.4
N$17
  Top 0.61: JP2.2 64.33,5 62.34,6.98 59.94,6.98 | IC4.7 50.67,14.47 58.16,6.98 59.94,6.98 | IC4.8 59.94,6.98
N$18
  Top 0.61: IC4.5 48.13,13.71 56.84,5 58.5,5 | 58.5,5 49.4,14.1 IC4.6 | 58.5,5 JP2.1
N$19
  Top 0.254: IC5.2 66.8,23.23 R15.1
N$20
  Top 0.254: IC5.4 64.26,25.11 R16.1
N$21
  Top 0.61: IC5.7 66.8,14.47 74.54,6.73 JP2.6 74.54,8.51 IC5.8
N$22
  Top 0.61: JP2.5 72,7.24 IC5.5 IC5.6
N$23
  Top 0.254: R19.1 81.95,21.56 82,21.51 82.13,21.51 82.29,21.35 82.29,21.22 IC6.2
N$25
  Top 0.61: IC6.7 82.93,5.77 JP2.9 84.2,7.04 IC6.8
N$35
  Top 0.254: IC9.2 65.15,75.15 64.17,74.17 R31.1
N$36
  Top 0.254: IC9.4 67.69,73.48 R32.1
N$37
  Top 0.61: IC9.7 65.15,90.69 JP1.4 63.88,89.42 IC9.8
N$38
  Top 0.61: IC9.5 67.69,90.69 JP1.5 66.42,89.42 IC9.6
N$39
  Top 0.254: IC10.4 82.42,74.13 R36.1
N$40
  Top 0.61: IC10.7 79.88,94.74 JP1.8 78.61,93.99 IC10.8
N$41
  Top 0.61: IC10.5 82.42,84.08 82.41,84.09 82.41,94.75 JP1.9 81.15,93.99 IC10.6
N$42
  Top 0.254: IC11.2 58.74,24 R39.1
N$43
  Top 0.254: IC11.4 55.47,21.3 R40.1
N$44
  Top 0.61: JP2.4 60.01,14.45 IC11.8 IC11.7
N$45
  Top 0.254: IC11.6 57.47,14.45
  Top 0.61: IC11.5 56.2,14.47 63.69,6.98 64.94,6.98 JP2.3 57.47,14.45
N$46
  Top 0.254: IC12.2 74.87,22.47 R43.1
N$47
  Top 0.254: IC12.4 72.33,24.34 R44.1
N$48
  Top 0.61: IC12.7 IC12.8 79.62,11.5 JP2.8
N$49
  Top 0.61: IC12.5 72.33,14.22 77.08,9.46 JP2.7 77.08,10.99 73.6,14.47 IC12.6
SWC  (via drill 0.35)
  Top 0.254: J2.4 25.93,10.06 25.91,10.08 46.11,30.28 v46.17,30.28 | v46.2,32.84 61.36,48 IC1.31
  Bottom 0.254: v46.17,30.28 46.17,32.81 v46.2,32.84
SWD
  Top 0.254: IC1.32 49.26,31.04 46,31.04 24.66,9.7 J2.2
VBUS  (via drill 0.35)
  Top 0.254: U1.1 14.39,10.69 C1.1
  Top 0.406: J1.VBUS2 10.57,10.75 v10.71,10.89 | J1.VBUS1 9.57,15.65
  pour Bottom: -0.25,100.58 150.37,100.58 151.64,99.31 151.64,0.76 152.91,-0.51 149.86,-3.56 -1.78,-3.56 -4.57,-0.76 -4.57,99.82
  pour Top: 18.03,15.85 18.03,10.57 0.76,10.57 0.76,15.85

### Text on the board
tNames: 5V PA22 PA19 PA18 PA17 PA16 PA15 PA14 PA11 | 180R | GND | Data | VCC | 10k | 10k | Reset | 1uF | 10k | 180R | 10k | 1uF | 10uF | 10uF | PA02 PA03 PA04 PA05 PA06 PA07 PA08 PA09 PA10
bNames: DHT22 | Thermochromic Temperature & Humidity Display v2